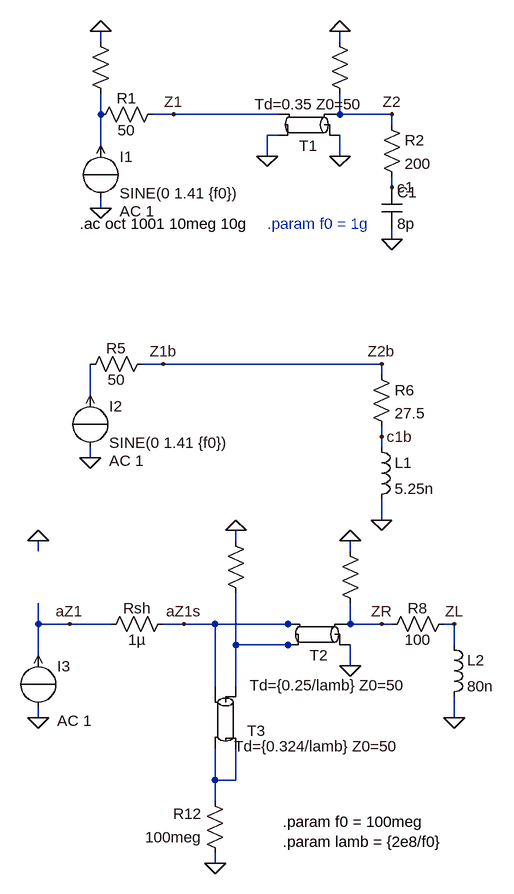
[diagram p0: schematic leitungsanpassung_skript_S74_GHET.asc]
leitungsanpassung_skript_S74_GHET.asc, the LTspice schematic file:
Version 4
SHEET 1 880 1172
WIRE -320 -192 -320 -208
WIRE 48 -192 48 -208
WIRE -320 -80 -320 -112
WIRE -208 -80 -240 -80
WIRE -48 -80 -208 -80
WIRE 48 -80 48 -112
WIRE 128 -80 48 -80
WIRE 128 -64 128 -80
WIRE -48 -48 -64 -48
WIRE -320 -32 -320 -80
WIRE -64 -16 -64 -48
WIRE 48 -16 48 -48
WIRE 128 32 128 16
WIRE -320 64 -320 48
WIRE 128 112 128 96
WIRE -224 304 -256 304
WIRE 112 304 -224 304
WIRE 112 320 112 304
WIRE -336 352 -336 304
WIRE 112 416 112 400
WIRE 112 432 112 416
WIRE -336 448 -336 432
WIRE 112 544 112 512
WIRE -112 576 -112 560
WIRE -416 592 -416 576
WIRE 64 592 64 576
WIRE -416 704 -416 672
WIRE -368 704 -416 704
WIRE -304 704 -368 704
WIRE -192 704 -224 704
WIRE -144 704 -192 704
WIRE -32 704 -144 704
WIRE -16 704 -32 704
WIRE 64 704 64 672
WIRE 112 704 64 704
WIRE 128 704 112 704
WIRE 224 704 208 704
WIRE -112 736 -112 656
WIRE -32 736 -112 736
WIRE -16 736 -32 736
WIRE 224 736 224 704
WIRE -416 752 -416 704
WIRE 64 768 64 736
WIRE -144 800 -144 704
WIRE -112 800 -112 736
WIRE -416 848 -416 832
WIRE 224 848 224 816
WIRE -144 944 -144 896
WIRE -112 944 -112 896
WIRE -112 944 -144 944
WIRE -144 976 -144 944
WIRE -144 1072 -144 1056
FLAG -320 64 0
FLAG 48 -208 0
FLAG -320 -208 0
FLAG 128 -80 Z2
FLAG -208 -80 Z1
FLAG -64 -16 0
FLAG 48 -16 0
FLAG 128 112 0
FLAG 128 32 c1
FLAG -336 448 0
FLAG 112 304 Z2b
FLAG -224 304 Z1b
FLAG 112 544 0
FLAG 112 416 c1b
FLAG -416 848 0
FLAG 64 576 0
FLAG -368 704 aZ1
FLAG 64 768 0
FLAG 224 848 0
FLAG -144 1072 0
FLAG -416 576 0
FLAG -112 560 0
FLAG 112 704 ZR
FLAG 224 704 ZL
FLAG -192 704 aZ1s
SYMBOL source-I -320 -32 R0
WINDOW 123 29 101 Left 2
WINDOW 39 0 0 Left 2
SYMATTR Value2 AC 1
SYMATTR InstName I1
SYMATTR Value SINE(0 1.41 {f0})
SYMBOL res -336 -64 R270
WINDOW 0 25 56 VTop 2
WINDOW 3 7 56 VBottom 2
SYMATTR InstName R1
SYMATTR Value 50
SYMBOL res 112 -80 R0
SYMATTR InstName R2
SYMATTR Value 200
SYMBOL res -336 -208 R0
WINDOW 0 36 40 Invisible 2
WINDOW 3 36 76 Invisible 2
SYMATTR InstName R3
SYMATTR Value 100meg
SYMBOL res 32 -208 R0
WINDOW 0 36 40 Invisible 2
WINDOW 3 36 76 Invisible 2
SYMATTR InstName R4
SYMATTR Value 100meg
SYMBOL tline 0 -64 R180
SYMATTR InstName T1
SYMATTR Value Td=0.35 Z0=50
SYMBOL cap 112 32 R0
SYMATTR InstName C1
SYMATTR Value 8p
SYMBOL source-I -336 352 R0
WINDOW 123 29 101 Left 2
WINDOW 39 0 0 Left 2
SYMATTR Value2 AC 1
SYMATTR InstName I2
SYMATTR Value SINE(0 1.41 {f0})
SYMBOL res -352 320 R270
WINDOW 0 25 56 VTop 2
WINDOW 3 7 56 VBottom 2
SYMATTR InstName R5
SYMATTR Value 50
SYMBOL res 96 304 R0
SYMATTR InstName R6
SYMATTR Value 27.5
SYMBOL ind 96 416 R0
SYMATTR InstName L1
SYMATTR Value 5.25n
SYMBOL source-I -416 752 R0
WINDOW 123 29 101 Left 2
WINDOW 39 0 0 Left 2
SYMATTR Value2 AC 1
SYMATTR InstName I3
SYMATTR Value ""
SYMBOL res 48 576 R0
WINDOW 0 36 40 Invisible 2
WINDOW 3 36 76 Invisible 2
SYMATTR InstName R10
SYMATTR Value 100meg
SYMBOL tline 16 720 R180
WINDOW 3 -14 -94 Top 2
SYMATTR Value Td={0.25/lamb} Z0=50
SYMATTR InstName T2
SYMBOL res 112 720 R270
WINDOW 0 25 56 VTop 2
WINDOW 3 7 56 VBottom 2
SYMATTR InstName R8
SYMATTR Value 100
SYMBOL ind 208 720 R0
SYMATTR InstName L2
SYMATTR Value 80n
SYMBOL tline -128 848 R90
WINDOW 0 5 -48 VTop 2
WINDOW 3 60 -141 VBottom 2
SYMATTR InstName T3
SYMATTR Value Td={0.324/lamb} Z0=50
SYMBOL res -128 1072 R180
WINDOW 0 36 76 Left 2
WINDOW 3 36 40 Left 2
SYMATTR InstName R12
SYMATTR Value 100meg
SYMBOL res -128 560 R0
WINDOW 0 36 40 Invisible 2
WINDOW 3 36 76 Invisible 2
SYMATTR InstName R11
SYMATTR Value 100meg
SYMBOL res -320 720 R270
WINDOW 0 25 56 VTop 2
WINDOW 3 7 56 VBottom 2
SYMATTR InstName Rsh
SYMATTR Value 1µ
TEXT -352 88 Left 2 !.ac oct 1001 10meg 10g
TEXT -64 88 Left 2 ;.param f0 = 1g
TEXT -40 1008 Left 2 !.param f0 = 100meg\n.param lamb = {2e8/f0}

The netlist it stands for:
* leitungsanpassung_skript_S74_GHET.asc
I1 0 N001 SINE(0 1.41 {f0}) AC 1
R1 N001 Z1 50
R2 Z2 c1 200
R3 0 N001 100meg
R4 0 Z2 100meg
T1 0 Z2 0 Z1 Td=0.35 Z0=50
C1 c1 0 8p
I2 0 N002 SINE(0 1.41 {f0}) AC 1
R5 N002 Z1b 50
R6 Z1b c1b 27.5
L1 c1b 0 5.25n
I3 0 aZ1 AC 1
R10 0 ZR 100meg
T2 0 ZR N003 aZ1s Td={0.25/lamb} Z0=50
R8 ZR ZL 100
L2 ZL 0 80n
T3 N003 aZ1s N004 N004 Td={0.324/lamb} Z0=50
R12 0 N004 100meg
R11 0 N003 100meg
Rsh aZ1 aZ1s 1µ
.ac oct 1001 10meg 10g
* .param f0 = 1g
.param f0 = 100meg
.param lamb = {2e8/f0}
.backanno
.end